# Altium project MEGABIT with 2ICs - REVISION 1.PrjPcb
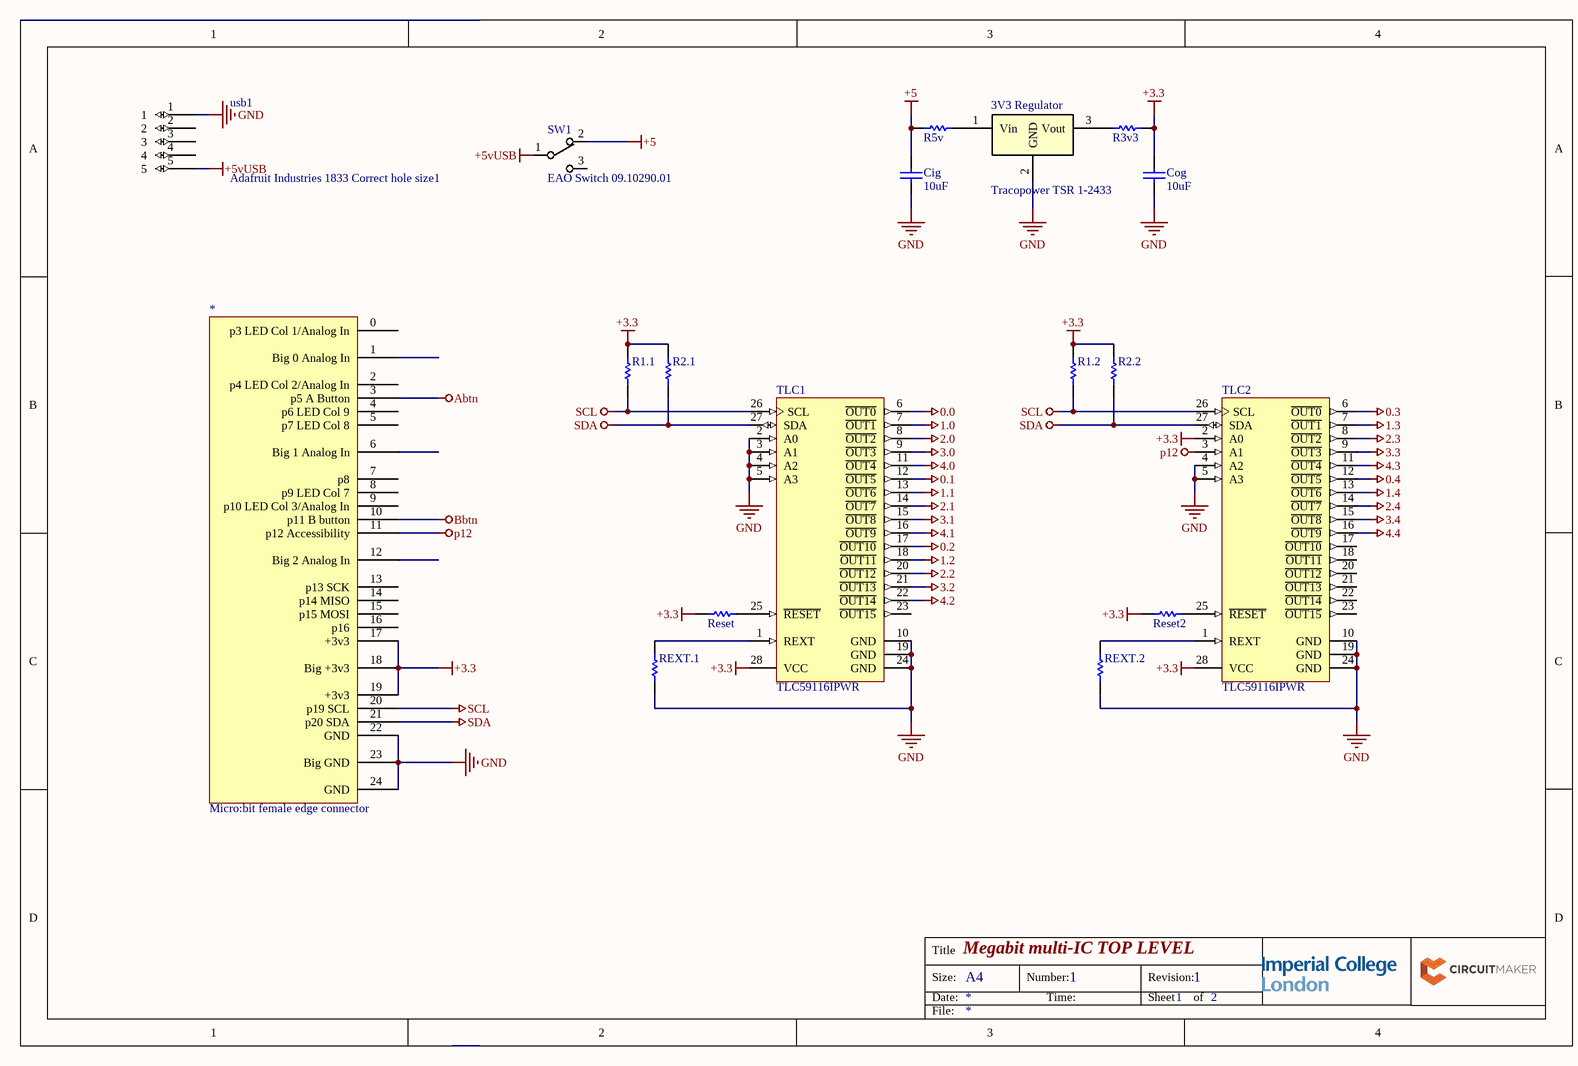
[diagram p0: megabit-I2C-TOP.SchDoc]
2 sheets, 43 parts. Net scope: global (net labels, ports and power ports of the same name join across sheets).
Sheets:
  megabit-I2C-TOP.SchDoc
  LED matrix.SchDoc

## Sheet megabit-I2C-TOP.SchDoc: Megabit multi-IC TOP LEVEL
size A4; DrawnBy: Megabit Team; DocumentNumber: 1; Revision: 1; SheetNumber: 1; SheetTotal: 2

### Parts
3V3_Regulator  Tracopower TSR 1-2433  [PCB-vczw4772xz5kvcrv4x78-1]
*  Micro:bit female edge connector  [PCBComponent_1 - duplicate]
Cig  10uF  [Vishay K104K15X7RF5TL2]
Cog  10uF  [Vishay K104K15X7RF5TL2]
R1.1  Res1  [PCB-3613466-1]  (value not drawn)
R1.2  Res1  [PCB-3613466-1]  (value not drawn)
R2.1  Res1  [PCB-3613466-1]  (value not drawn)
R2.2  Res1  [PCB-3613466-1]  (value not drawn)
R3v3  Res1  [PCB-3613466-1]  (value not drawn)
R5v  Res1  [PCB-3613466-1]  (value not drawn)
Reset  Res1  [PCB-3613466-1]  (value not drawn)
Reset2  Res1  [PCB-3613466-1]  (value not drawn)
REXT.1  R-EXT  [PCB-3613466-1]  (value not drawn)
REXT.2  R-EXT  [PCB-3613466-1]  (value not drawn)
SW1  EAO Switch 09.10290.01  [PCB-1akl86m7w5ikau1ha4dm-1]
TLC1  TLC59116IPWR  [TI-PW28_L]
TLC2  TLC59116IPWR  [TI-PW28_L]
usb1  Adafruit Industries 1833 Correct hole size1  [PCB-lrx1ysvqy1j2hi3n37c6-1]

### Nets
0.0: TLC1.6(~{OUT0})
0.1: TLC1.12(~{OUT5})
0.2: TLC1.17(~{OUT10})
0.3: TLC2.6(~{OUT0})
0.4: TLC2.12(~{OUT5})
1.0: TLC1.7(~{OUT1})
1.1: TLC1.13(~{OUT6})
1.2: TLC1.18(~{OUT11})
1.3: TLC2.7(~{OUT1})
1.4: TLC2.13(~{OUT6})
2.0: TLC1.8(~{OUT2})
2.1: TLC1.14(~{OUT7})
2.2: TLC1.20(~{OUT12})
2.3: TLC2.8(~{OUT2})
2.4: TLC2.14(~{OUT7})
3.0: TLC1.9(~{OUT3})
3.1: TLC1.15(~{OUT8})
3.2: TLC1.21(~{OUT13})
3.3: TLC2.9(~{OUT3})
3.4: TLC2.15(~{OUT8})
4.0: TLC1.11(~{OUT4})
4.1: TLC1.16(~{OUT9})
4.2: TLC1.22(~{OUT14})
4.3: TLC2.11(~{OUT4})
4.4: TLC2.16(~{OUT9})
+3.3: *.17(+3v3) *.18(Big_+3v3) *.19(+3v3) Cog.2 R1.1.2 R1.2.2 R2.1.2 R2.2.2 R3v3.2 Reset.1 Reset2.1 TLC1.28(VCC) TLC2.2(A0) TLC2.28(VCC)
+5: Cig.2 R5v.1 SW1.2
+5vUSB: SW1.1 usb1.5
Abtn: *.3(p5_A_Button)
Bbtn: *.10(p11_B_button)
GND: 3V3_Regulator.2(GND) *.22(GND) *.23(Big_GND) *.24(GND) Cig.1 Cog.1 REXT.1.1 REXT.2.1 TLC1.2(A0) TLC1.3(A1) TLC1.4(A2) TLC1.5(A3) TLC1.10(GND) TLC1.19(GND) TLC1.24(GND) TLC2.4(A2) TLC2.5(A3) TLC2.10(GND) TLC2.19(GND) TLC2.24(GND) usb1.1
p12: *.11(p12_Accessibility) TLC2.3(A1)
SCL: *.20(p19_SCL) R1.1.1 R1.2.1 TLC1.26(SCL) TLC2.26(SCL)
SDA: *.21(p20_SDA) R2.1.1 R2.2.1 TLC1.27(SDA) TLC2.27(SDA)
Net3V3_Regulator_1: 3V3_Regulator.1(Vin) R5v.2
Net3V3_Regulator_3: 3V3_Regulator.3(Vout) R3v3.1
NetReset2_2: Reset2.2 TLC2.25(~{RESET})
NetReset_2: Reset.2 TLC1.25(~{RESET})
NetREXT.1_2: REXT.1.2 TLC1.1(REXT)
NetREXT.2_2: REXT.2.2 TLC2.1(REXT)

Not connected (* = marked no-connect by the designer): * 0(p3_LED_Col_1/Analog_In) 1(Big_0_Analog_In) 2(p4_LED_Col_2/Analog_In) 4(p6_LED_Col_9) 5(p7_LED_Col_8) 6(Big_1_Analog_In) 7(p8) 8(p9_LED_Col_7) 9(p10_LED_Col_3/Analog_In) 12(Big_2_Analog_In) 13(p13_SCK) 14(p14_MISO) 15(p15_MOSI) 16(p16); SW1 3; TLC1 23(~{OUT15}); TLC2 17(~{OUT10}) 18(~{OUT11}) 20(~{OUT12}) 21(~{OUT13}) 22(~{OUT14}) 23(~{OUT15}); usb1 2 3 4

### Notes on the sheet
- Title
- Size:
- Date:
- A4
- Number:
- Time:
- Revision:
- Sheet
- of
- File:

### Library data of the parts
3V3_Regulator = CMP-395cf0c79334e69b-1: 1 A Watt, 4.75-36VDCVin, Quad Output, 3.3 V@1 A Switching Regulators DC-DC Converter; Number of Outputs: 1; Output Voltage: 3.30 V; Input Voltage (DC): 4.75 V to 36.0 V; Output Current: 1.00 A; RoHS: Compliant; REACH SVHC Compliance: No SVHC; Size-Width: 7.60 mm; Mounting Style: PCB; Octopart URL: http://octopart.com/tsr+1-2433-tracopower-9539342; Size-Height: 10.2 mm; Manufacturer Part Number: TSR 1-2433; OctopartID: 395cf0c79334e69b
* = CMP-mom7rix79jkpy4z4w6go-14: http://www.dgyuliang.net/html/279.html; CustomComponentID: mom7rix79jkpy4z4w6go
Cig Cog = CMP-124240-16: K Series 100nF 50 V ±10 % Tolerance X7R Radial Multilayer Ceramic Capacitor; Manufacturer Part Number: K104K15X7RF5TL2; Lead Length: 30mm; Lead-Free Status: Lead Free; Voltage Rating (DC): 50 V; Capacitance Tolerance: ±10%; Size-Height: 5.6mm; Size-Width: 4.0mm; Mounting Style: Through Hole; OctopartID: e7292e20c87538ee; Number of Pins: 2; Packaging: Cut Tape (CT), Tape & Reel (TR); Capacitance: 100 nF; Octopart URL: http://octopart.com/k104k15x7rf5tl2-vishay+bccomponents-199226; Dielectric Material: Ceramic; Dielectric Characteristic: X7R; Size-Lead Diameter: 0.5mm; RoHS: Compliant; Size-Thickness: 2.6mm
R1.1 R1.2 R2.1 R2.2 R3v3 R5v Reset Reset2 REXT.1 REXT.2 = CMP-b15c796618a36e9b-3: Resistor 0.25W; OctopartID: b15c796618a36e9b
SW1 = CMP-a30d6b12014b7cca-5: SLIDE SWITCH, SPDT, HORIZ; Series: 1K2; Switch Function Type: SPDT, R/A; Contact Configuration: SPDT; Voltage, Contac...; Insulation Resistance: 10.0 GΩ; Contact Resistance: 22.0 mΩ; Octopart URL: http://octopart.com/09.10290.01-eao+switch-18188064; Manufacturer Part Number: 09.10290.01; Orientation: Right Angle; RoHS: Compliant; Mounting Style: PCB; Contacts Type: SPDT; OctopartID: a30d6b12014b7cca
TLC1 TLC2 = CMP-1160291-2: 16-Bit Fast-Mode Plus (FM+) I2C Bus Constant-Current LED Sink Driver, 3 to 5.5 V, -40 to 85 degC, 28-pin SOP (PW28), Green (RoHS & no Sb/Br); Lead-Free Status: Lead Free; Number of Outputs: 16; Output Current: 0.12 A; Output Voltage: 17.0 V; Lifecycle Status: Active; Mounting Style: Surface Mount; Number of Pins: 28; Octopart Url: https://octopart.com/tlc59116ipwr-texas+instruments-7982361; OctopartID: 667eaf0d8e01b9b9; Packaging: Cut Tape (CT); REACH SVHC Compliance: No SVHC; RoHS: Compliant
usb1 = CMP-bfb17591a6f36076-4: Standoff; Threaded Female 1/4 Hex; 6-32 Thread; Length .875; Brass/Zinc; Manufacturer Part Number: 1833; Lead-Free Status: Lead Free; Gender: Female; Octopart URL: http://octopart.com/1833-adafruit+industries-53099556; OctopartID: bfb17591a6f36076; Size-Length: 22.2 mm; RoHS: Compliant; Material: Brass; Size-Diameter: 6.35 mm; Size-Width: 6.35 mm

## Sheet LED matrix.SchDoc: Megabit LED Matrix
size A4; DocumentNumber: 1; Revision: 1; SheetNumber: 2; SheetTotal: 2
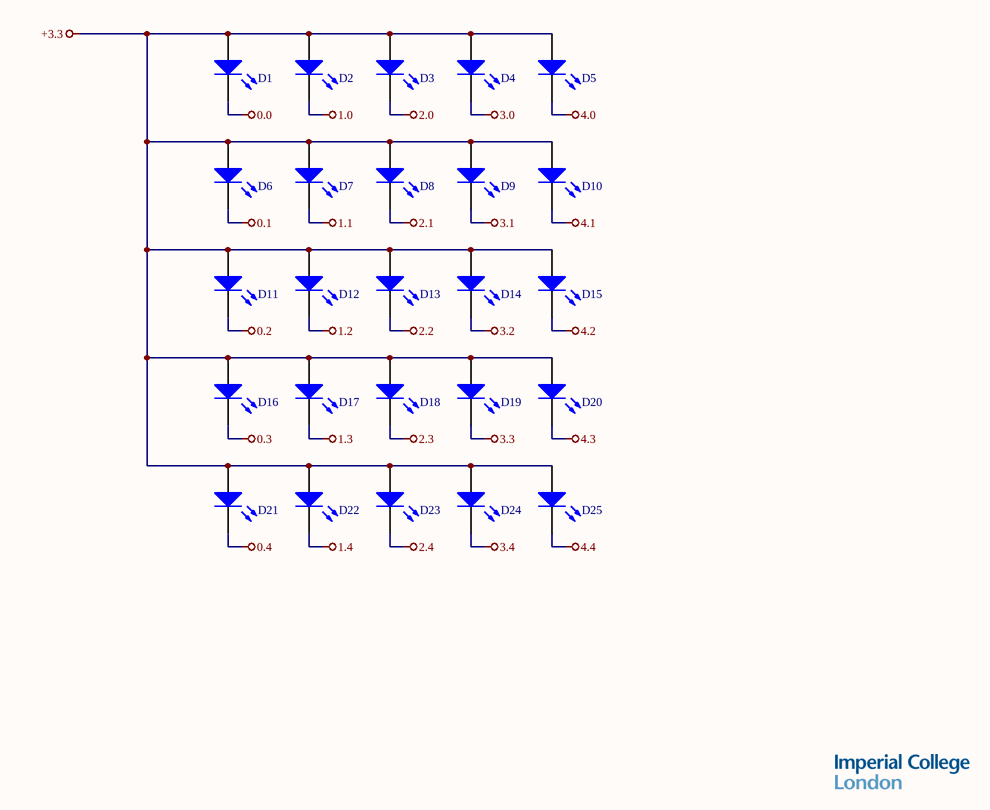
[diagram p1: LED matrix.SchDoc]

### Parts
D1  LED  [PCBComponent_1 - duplicate]  (value not drawn)
D2  LED  [PCBComponent_1 - duplicate]  (value not drawn)
D3  LED  [PCBComponent_1 - duplicate]  (value not drawn)
D4  LED  [PCBComponent_1 - duplicate]  (value not drawn)
D5  LED  [PCBComponent_1 - duplicate]  (value not drawn)
D6  LED  [PCBComponent_1 - duplicate]  (value not drawn)
D7  LED  [PCBComponent_1 - duplicate]  (value not drawn)
D8  LED  [PCBComponent_1 - duplicate]  (value not drawn)
D9  LED  [PCBComponent_1 - duplicate]  (value not drawn)
D10  LED  [PCBComponent_1 - duplicate]  (value not drawn)
D11  LED  [PCBComponent_1 - duplicate]  (value not drawn)
D12  LED  [PCBComponent_1 - duplicate]  (value not drawn)
D13  LED  [PCBComponent_1 - duplicate]  (value not drawn)
D14  LED  [PCBComponent_1 - duplicate]  (value not drawn)
D15  LED  [PCBComponent_1 - duplicate]  (value not drawn)
D16  LED  [PCBComponent_1 - duplicate]  (value not drawn)
D17  LED  [PCBComponent_1 - duplicate]  (value not drawn)
D18  LED  [PCBComponent_1 - duplicate]  (value not drawn)
D19  LED  [PCBComponent_1 - duplicate]  (value not drawn)
D20  LED  [PCBComponent_1 - duplicate]  (value not drawn)
D21  LED  [PCBComponent_1 - duplicate]  (value not drawn)
D22  LED  [PCBComponent_1 - duplicate]  (value not drawn)
D23  LED  [PCBComponent_1 - duplicate]  (value not drawn)
D24  LED  [PCBComponent_1 - duplicate]  (value not drawn)
D25  LED  [PCBComponent_1 - duplicate]  (value not drawn)

### Nets
0.0: D1.2(K)
0.1: D6.2(K)
0.2: D11.2(K)
0.3: D16.2(K)
0.4: D21.2(K)
1.0: D2.2(K)
1.1: D7.2(K)
1.2: D12.2(K)
1.3: D17.2(K)
1.4: D22.2(K)
2.0: D3.2(K)
2.1: D8.2(K)
2.2: D13.2(K)
2.3: D18.2(K)
2.4: D23.2(K)
3.0: D4.2(K)
3.1: D9.2(K)
3.2: D14.2(K)
3.3: D19.2(K)
3.4: D24.2(K)
4.0: D5.2(K)
4.1: D10.2(K)
4.2: D15.2(K)
4.3: D20.2(K)
4.4: D25.2(K)
+3.3: D1.1(A) D2.1(A) D3.1(A) D4.1(A) D5.1(A) D6.1(A) D7.1(A) D8.1(A) D9.1(A) D10.1(A) D11.1(A) D12.1(A) D13.1(A) D14.1(A) D15.1(A) D16.1(A) D17.1(A) D18.1(A) D19.1(A) D20.1(A) D21.1(A) D22.1(A) D23.1(A) D24.1(A) D25.1(A)

### Notes on the sheet
- Title
- Size:
- Date:
- A4
- Number:
- Time:
- Revision:
- Sheet
- of
- File:

### Library data of the parts
D1-D25 = CMP-c7440e1cac271883-4: L-793SRD-E, Round Series Red LED, 640 nm 8 mm, Round Lens Through Hole package; Mounting Style: Through Hole, PCB

## Nets that join several sheets
0.0: megabit-I2C-TOP (TLC1.6), LED matrix (D1.2)
0.1: megabit-I2C-TOP (TLC1.12), LED matrix (D6.2)
0.2: megabit-I2C-TOP (TLC1.17), LED matrix (D11.2)
0.3: megabit-I2C-TOP (TLC2.6), LED matrix (D16.2)
0.4: megabit-I2C-TOP (TLC2.12), LED matrix (D21.2)
1.0: megabit-I2C-TOP (TLC1.7), LED matrix (D2.2)
1.1: megabit-I2C-TOP (TLC1.13), LED matrix (D7.2)
1.2: megabit-I2C-TOP (TLC1.18), LED matrix (D12.2)
1.3: megabit-I2C-TOP (TLC2.7), LED matrix (D17.2)
1.4: megabit-I2C-TOP (TLC2.13), LED matrix (D22.2)
2.0: megabit-I2C-TOP (TLC1.8), LED matrix (D3.2)
2.1: megabit-I2C-TOP (TLC1.14), LED matrix (D8.2)
2.2: megabit-I2C-TOP (TLC1.20), LED matrix (D13.2)
2.3: megabit-I2C-TOP (TLC2.8), LED matrix (D18.2)
2.4: megabit-I2C-TOP (TLC2.14), LED matrix (D23.2)
3.0: megabit-I2C-TOP (TLC1.9), LED matrix (D4.2)
3.1: megabit-I2C-TOP (TLC1.15), LED matrix (D9.2)
3.2: megabit-I2C-TOP (TLC1.21), LED matrix (D14.2)
3.3: megabit-I2C-TOP (TLC2.9), LED matrix (D19.2)
3.4: megabit-I2C-TOP (TLC2.15), LED matrix (D24.2)
4.0: megabit-I2C-TOP (TLC1.11), LED matrix (D5.2)
4.1: megabit-I2C-TOP (TLC1.16), LED matrix (D10.2)
4.2: megabit-I2C-TOP (TLC1.22), LED matrix (D15.2)
4.3: megabit-I2C-TOP (TLC2.11), LED matrix (D20.2)
4.4: megabit-I2C-TOP (TLC2.16), LED matrix (D25.2)
+3.3: megabit-I2C-TOP (14 pins), LED matrix (25 pins)